# Altium schematic sheet USBC_Connector.SchDoc
size B; SheetNumber: 2; SheetTotal: 2
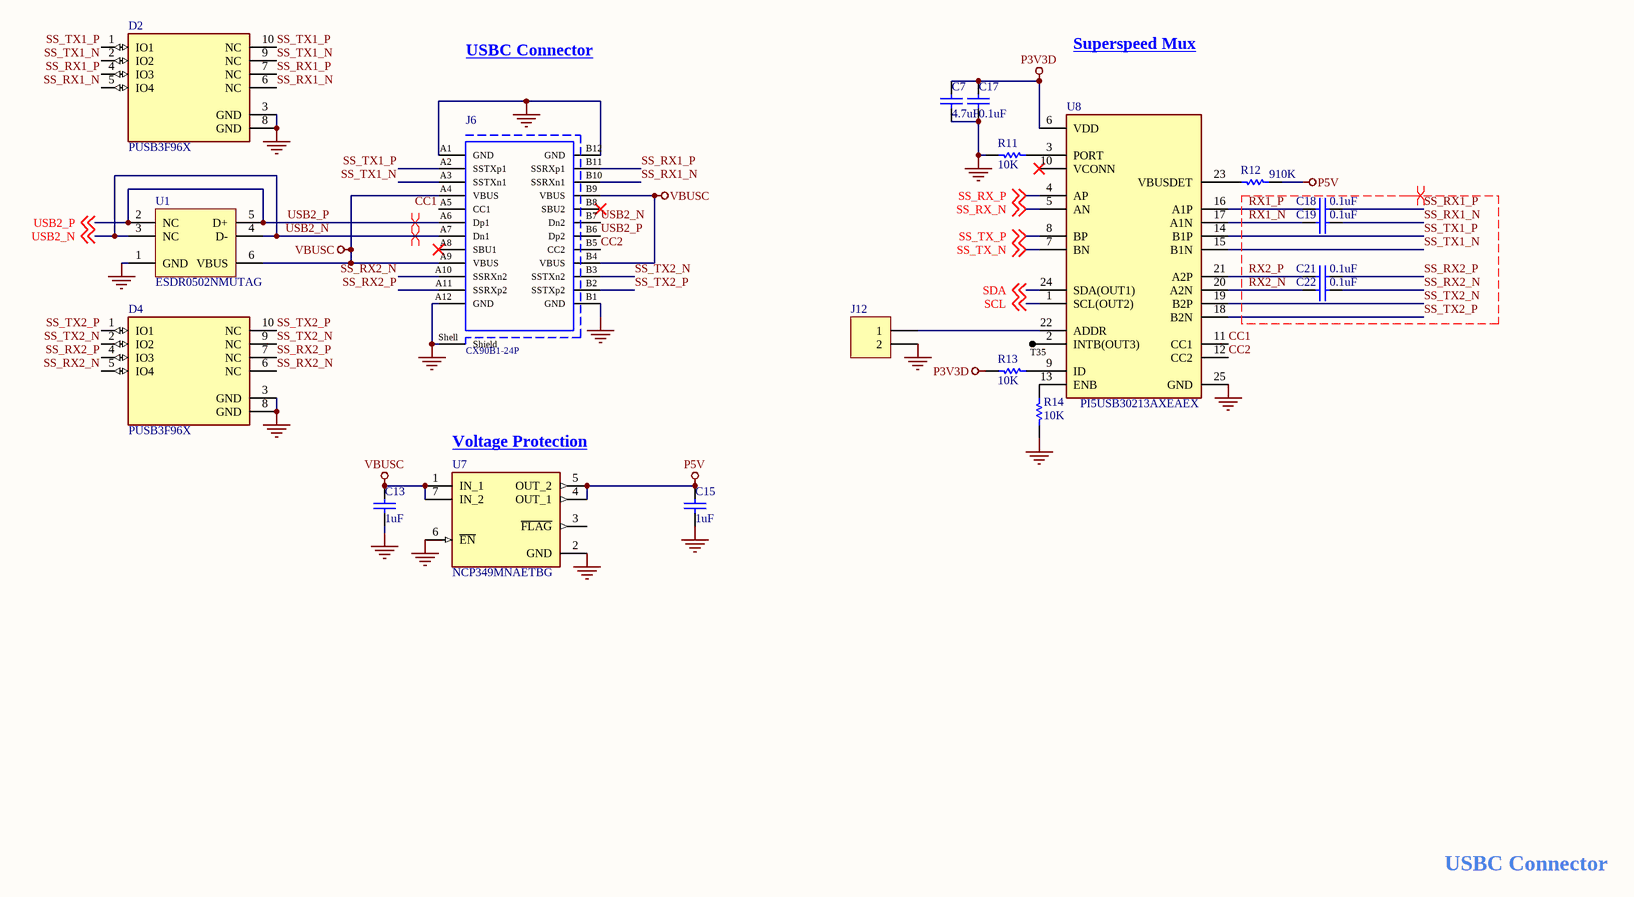
[diagram p0: USBC_Connector.SchDoc]

## Parts
C7  4.7uF  [CAPC1005X55USR]
C13  1uF  [CAPC1005X55USR]
C15  1uF  [CAPC1005X55USR]
C17  0.1uF  [CAPC1005X55USR]
C18  0.1uF  [CAPC1005X55USR]
C19  0.1uF  [CAPC1005X55USR]
C21  0.1uF  [CAPC1005X55USR]
C22  0.1uF  [CAPC1005X55USR]
D2  PUSB3F96X  [DFN2510A-10]
D4  PUSB3F96X  [DFN2510A-10]
J6  CX90B1-24P  [HRS_CX90B1-24P]
J12  Header 2X1_2.54MM  [HDR2X1_MALE_2.54MM]  (value not drawn)
R11  10K  [RESC1005X40USR]
R12  910K  [RESC1005X40USR]
R13  10K  [RESC1005X40USR]
R14  10K  [RESC1005X40USR]
T35  TP_S  [TP 20mil]  (value not drawn)  (no BOM)
U1  ESDR0502NMUTAG  [ONSC-UDFN-6-517AA-01_V]
U7  NCP349MNAETBG  [SON50P200X160X100-7N-D]
U8  PI5USB30213AXEAEX  [QFN40P400X200X50-25N]

## Nets
GND: C7.1 C13.1 C15.1 C17.1 D2.3(GND) D2.8(GND) D4.3(GND) D4.8(GND) J6.A1(GND) J6.A12(GND) J6.B1(GND) J6.B12(GND) J6.Shell(Shield) J12.2 R11.1 R14.2 U1.1(GND) U7.2(GND) U7.6(~{EN}) U8.25(GND)
P3V3D: C7.2 C17.2 R13.1 U8.6(VDD)
P5V: C15.2 R12.2 U7.4(OUT_1) U7.5(OUT_2)
VBUSC: C13.2 J6.A4(VBUS) J6.A9(VBUS) J6.B4(VBUS) J6.B9(VBUS) U1.6(VBUS) U7.1(IN_1) U7.7(IN_2)
CC1: J6.A5(CC1) U8.11(CC1)
CC2: J6.B5(CC2) U8.12(CC2)
RX1_N: C19.1 U8.17(A1N)
RX1_P: C18.1 U8.16(A1P)
RX2_N: C22.1 U8.20(A2N)
RX2_P: C21.1 U8.21(A2P)
SCL: U8.1(SCL(OUT2)) ; off-sheet SCL
SDA: U8.24(SDA(OUT1)) ; off-sheet SDA
SS_RX1_N: C19.2 D2.5(IO4) D2.6(NC) J6.B10(SSRXn1)
SS_RX1_P: C18.2 D2.4(IO3) D2.7(NC) J6.B11(SSRXp1)
SS_RX2_N: C22.2 D4.5(IO4) D4.6(NC) J6.A10(SSRXn2)
SS_RX2_P: C21.2 D4.4(IO3) D4.7(NC) J6.A11(SSRXp2)
SS_RX_N: U8.5(AN) ; off-sheet SS_RX_N
SS_RX_P: U8.4(AP) ; off-sheet SS_RX_P
SS_TX1_N: D2.2(IO2) D2.9(NC) J6.A3(SSTXn1) U8.15(B1N)
SS_TX1_P: D2.1(IO1) D2.10(NC) J6.A2(SSTXp1) U8.14(B1P)
SS_TX2_N: D4.2(IO2) D4.9(NC) J6.B3(SSTXn2) U8.19(B2P)
SS_TX2_P: D4.1(IO1) D4.10(NC) J6.B2(SSTXp2) U8.18(B2N)
SS_TX_N: U8.7(BN) ; off-sheet SS_TX_N
SS_TX_P: U8.8(BP) ; off-sheet SS_TX_P
USB2_N: J6.A7(Dn1) J6.B7(Dn2) U1.3(NC) U1.4(D-) ; off-sheet USB2_N
USB2_P: J6.A6(Dp1) J6.B6(Dp2) U1.2(NC) U1.5(D+) ; off-sheet USB2_P
NetJ12_1: J12.1 U8.22(ADDR)
NetR11_2: R11.2 U8.3(PORT)
NetR12_1: R12.1 U8.23(VBUSDET)
NetR13_2: R13.2 U8.9(ID)
NetR14_1: R14.1 U8.13(ENB)
NetT35_1: T35.1 U8.2(INTB(OUT3))

Not connected (* = marked no-connect by the designer): J6 A8(SBU1)* B8(SBU2)*; U7 3(~{FLAG}); U8 10(VCONN)*

## Layout directives
differential pair: RX1_N, RX1_P, RX2_N, RX2_P, SS_RX1_N, SS_RX1_P, SS_RX2_N, SS_RX2_P, SS_TX1_N, SS_TX1_P, SS_TX2_N, SS_TX2_P, USB2_N, USB2_P

## Notes on the sheet
- USBC Connector
- Superspeed Mux
- (near U7) Voltage Protection

## Library data of the parts
C7 = CAP CER 4.7UF 10V X5R 0402: Manufacturer Part Number: C1005X5R1A475M050BC; Manufacturer: TDK Corporation; Supplier Part Number 1: 445-8023-1-ND; Package: 0402; value: 4.7uF; Supplier 1: Digi-Key; Height: 0.55mm; ComponentLink1Description: New link; ComponentLink1URL: *
C13 C15 = CAP CER 1UF 25V X5R 0402: Manufacturer Part Number: GRM155R61E105MA12D; Manufacturer: Murata Electronics; Part #: E-CAP-042; value: 1uF; Supplier Part Number 1: 490-10018-1-ND; Package: 0402; Supplier 1: Digi-Key; Height: 0.55mm; ComponentLink1Description: New link; ComponentLink1URL: *
C17-C19 C21 C22 = CAP CER 0.1UF 16V X7R 0402: Manufacturer Part Number: CGA2B1X7R1C104K050BC; Manufacturer: TDK Corporation; Supplier Part Number 1: 445-5613-2-ND; Package: 0402; Height: 0.55mm; Supplier 1: Digi-Key; value: 0.1uF
D2 D4 = PUSB3F96X: TVS DIODE 5.5VWM 4.6VC DFN2510A; Manufacturer: Nexperia USA Inc.; Interface: USB; Manufacturer Part Number: PUSB3F96X; Supplier 1: Digi-Key; Supplier Part Number 1: 1727-2030-1-ND
J6 = USB 3.1_HRS_CX90B1-24P: CONN RCP USB3.1 TYPEC 24P SMD RA; Manufacturer: Hirose Electric Co Ltd; Number of Contacts: 24; Supplier 1: Digi-Key; Supplier Part Number 1: H125778CT-ND; Manufacturer Part Number: CX90B1-24P; ComponentLink1URL: https://www.mouser.com/ds/2/445/632723x00011-782157.pdf?src-supplier=Mouser; ComponentLink1Description: https://www.mouser.com/ds/2/445/632723x00011-782157.pdf?src-supplier=Mouser; ComponentLink2URL: https://katalog.we-online.de/em/datasheet/632723x00011.pdf?src-supplier=Digi-Key; ComponentLink2Description: https://katalog.we-online.de/em/datasheet/632723x00011.pdf?src-supplier=Digi-Key
J12 = Header 2X1_2.54MM: CONN HEADER VERT 2POS 2.54MM; Manufacturer: Wurth Electronics; Manufacturer Part Number: 61300211121; Description: THT Vertical Pin Header WR-PHD, Pitch 2.54 mm, Single Row, 2 pins; Current Rating: 3A; Voltage Rating: 250V; Number of Positions: 2; Gender: Male; Contact Resistance: 20mR; Pitch: 0.1inch; Supplier 1: Digi-Key; Supplier Part Number 1: 732-5315-ND; RoHS: Yes; Category: Headers and Wire Housings; Stock: 137510; Pricing: 1=0.13000, 10=0.11300, 25=0.09400, 50=0.07900, 100=0.07100, 1000=0.06500 (USD); Mounting Technology: Through Hole; Contact Plating: Gold; Housing Material: PBT; Contact Material: Copper Alloy,Copper; Color: Black; Min Operating Temperature: -40°C; Max Operating Temperature: 125°C; Number of Rows: 1; Contact Gender: Male; Packaging: Bulk; Termination: Through Hole; Number of Contacts: 2; Series: WR-PHD; Contact Type: Male Pin; Operating Supply Voltage: 250V; Orientation: 5495OrientationType; Height: 8.94mm; Contact Mating Length: 0.236inch; Lead Free: Lead Free; RoHS Compliant: Yes; Reach SVHC Compliant: Unknown; ComponentLink1URL: https://datasheet.ciiva.com/13619/6130xx11121-48870-13619345.pdf?src-supplier=Mouser; ComponentLink1Description: https://datasheet.ciiva.com/13619/6130xx11121-48870-13619345.pdf?src-supplier=Mouser
R11 R13 R14 = RES SMD 10K OHM 1% 1/16W 0402: Manufacturer: Samsung Electro-Mechanics; Manufacturer Part Number: RC1005F103CS; Supplier Part Number 1: 1276-3431-2-ND; Package: 0402; Height: 0.4mm; Supplier 1: Digi-Key; value: 10K
R12 = RES 910K OHM 1% 1/16W 0402: Manufacturer: YAGEO; Manufacturer Part Number: RC0402FR-07910KL; Supplier Part Number 1: YAG3257CT-ND; Package: 0402; Height: 0.4mm; Supplier 1: Digi-Key; value: 910K
T35 = TP_S: test point
U1 = ONSC-ESDR0502N-UDFN-6-517AA-01: TVS DIODE 5.5VWM 6UDFN; Manufacturer: ON Semiconductor; ComponentLink2URL: http://www.onsemi.cn/pub_link/Collateral/ESDR0502N-D.PDF; ComponentLink3URL: http://www.onsemi.com/pub_link/Collateral/517AA.PDF; ComponentLink1Description: Manufacturer URL; ComponentLink2Description: Datasheet; ComponentLink3Description: Package Specification; ComponentLink1URL: http://www.onsemi.com/; Supplier Part Number 1: 863-ESDR0502NMUTAG; Manufacturer Part Number: ESDR0502NMUTAG; Supplier 1: Mouser
U7 = NCP349MNAETBG: IC CTLR OVP 28V W/NMOS 6-DFN; Manufacturer: ON Semiconductor; Min Supply Voltage: 1.2V; Operating Supply Current: 70uA; Height: 0.95mm; Supplier 1: Digi-Key; Manufacturer Part Number: NCP349MNAETBG; RoHS: Yes; Category: Power Management ICs; Stock 1: 1255; Pricing 1: 1=0.96000, 10=0.84700, 25=0.79520, 100=0.64900, 250=0.60284, 500=0.51304, 1000=0.41043 (USD); Mount: Surface Mount; Case/Package: DFN; Number of Pins: 6; Weight: 0.000744oz; Min Operating Temperature: -40°C; Max Operating Temperature: 85°C; Packaging: Tape and Reel; Package Quantity: 3000; Max Supply Voltage: 28V; Series: -; Length: 2mm; Width: 1.6mm; Reach SVHC Compliant: Yes; Lead Free: Lead Free; Halogen Free: Halogen Free; RoHS Compliant: Yes; ComponentLink1URL: https://datasheet.ciiva.com/1967/ncp349-d-1967888.pdf?src-supplier=Avnet; ComponentLink1Description: https://datasheet.ciiva.com/1967/ncp349-d-1967888.pdf?src-supplier=Avnet; ComponentLink2URL: https://datasheet.ciiva.com/6602/ncp349-d-6602421.pdf?src-supplier=Digi-Key; ComponentLink2Description: https://datasheet.ciiva.com/6602/ncp349-d-6602421.pdf?src-supplier=Digi-Key; ComponentLink3URL: https://datasheet.ciiva.com/6602/ncp349-d-6602425.pdf?src-supplier=Digi-Key; ComponentLink3Description: https://datasheet.ciiva.com/6602/ncp349-d-6602425.pdf?src-supplier=Digi-Key; Supplier Part Number 1: NCP349MNAETBGOSCT-ND
U8 = PI5USB30213XEAEX: USB Power SW DIST Single 2.7V to 5.5V 1.5A/3A 24-Pin TQFN T/R; Manufacturer: Diodes; Supplier 1: Digi-Key; Supplier Part Number 1: PI5USB30213XEAEXCT-ND; Manufacturer Part Number: PI5USB30213XEAEX; RoHS: Yes; Category: Power Management ICs; Stock: 3456; Pricing: 1=1.92000, 10=1.72200, 25=1.62480, 100=1.38450, 250=1.30000, 500=1.13750, 1000=0.94250 (USD); RoHS Compliant: Yes; ComponentLink1URL: https://media.digikey.com/pdf/Data%20Sheets/Pericom%20PDFs/PI5USB30213_Web.pdf?src-supplier=Digi-Key; ComponentLink1Description: https://media.digikey.com/pdf/Data%20Sheets/Pericom%20PDFs/PI5USB30213_Web.pdf?src-supplier=Digi-Key